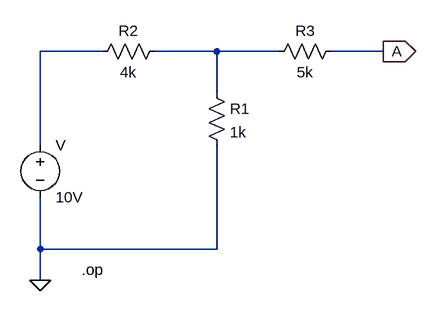
[diagram p0: schematic voltage-divider-5.asc]
voltage-divider-5.asc, the LTspice schematic file:
Version 4
SHEET 1 932 680
WIRE 240 144 144 144
WIRE 416 144 320 144
WIRE 512 144 416 144
WIRE 672 144 592 144
WIRE 416 208 416 144
WIRE 144 288 144 144
WIRE 144 448 144 368
WIRE 416 448 416 288
WIRE 416 448 144 448
WIRE 144 496 144 448
FLAG 144 496 0
FLAG 672 144 A
IOPIN 672 144 Out
SYMBOL voltage 144 272 R0
SYMATTR InstName V
SYMATTR Value 10V
SYMBOL Res 400 192 R0
SYMATTR InstName R1
SYMATTR Value 1k
SYMBOL Res 336 128 R90
WINDOW 0 0 56 VBottom 2
WINDOW 3 32 56 VTop 2
SYMATTR InstName R2
SYMATTR Value 4k
SYMBOL Res 608 128 R90
WINDOW 0 0 56 VBottom 2
WINDOW 3 32 56 VTop 2
SYMATTR InstName R3
SYMATTR Value 5k
TEXT 208 480 Left 2 !.op

The netlist it stands for:
* voltage-divider-5.asc
V N001 0 10V
R1 N002 0 1k
R2 N002 N001 4k
R3 A N002 5k
.op
.backanno
.end